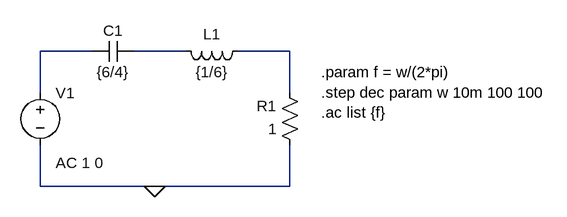
[diagram p0: schematic Draft1.asc]
Draft1.asc, the LTspice schematic file:
Version 4
SHEET 1 880 680
WIRE 128 80 48 80
WIRE 272 80 192 80
WIRE 432 80 352 80
WIRE 48 144 48 80
WIRE 432 144 432 80
WIRE 48 288 48 224
WIRE 224 288 48 288
WIRE 432 288 432 224
WIRE 432 288 224 288
FLAG 224 288 0
SYMBOL voltage 48 128 R0
WINDOW 123 24 124 Left 2
WINDOW 39 0 0 Left 0
SYMATTR InstName V1
SYMATTR Value ""
SYMATTR Value2 AC 1 0
SYMBOL res 448 240 R180
WINDOW 0 36 76 Left 2
WINDOW 3 36 40 Left 2
SYMATTR InstName R1
SYMATTR Value 1
SYMBOL cap 192 64 R90
WINDOW 0 0 32 VBottom 2
WINDOW 3 32 32 VTop 2
SYMATTR InstName C1
SYMATTR Value {6/4}
SYMBOL ind 368 64 R90
WINDOW 0 5 56 VBottom 2
WINDOW 3 32 56 VTop 2
SYMATTR InstName L1
SYMATTR Value {1/6}
TEXT 480 112 Left 2 !.param f = w/(2*pi)\n.step dec param w 10m 100 100\n.ac list {f}

The netlist it stands for:
* Draft1.asc
V1 N001 0 AC 1 0
R1 0 N003 1
C1 N002 N001 {6/4}
L1 N003 N002 {1/6}
.param f = w/(2*pi)
.step dec param w 10m 100 100
.ac list {f}
.backanno
.end